# EAGLE schematic Schematics (EAGLE 9.7.0)
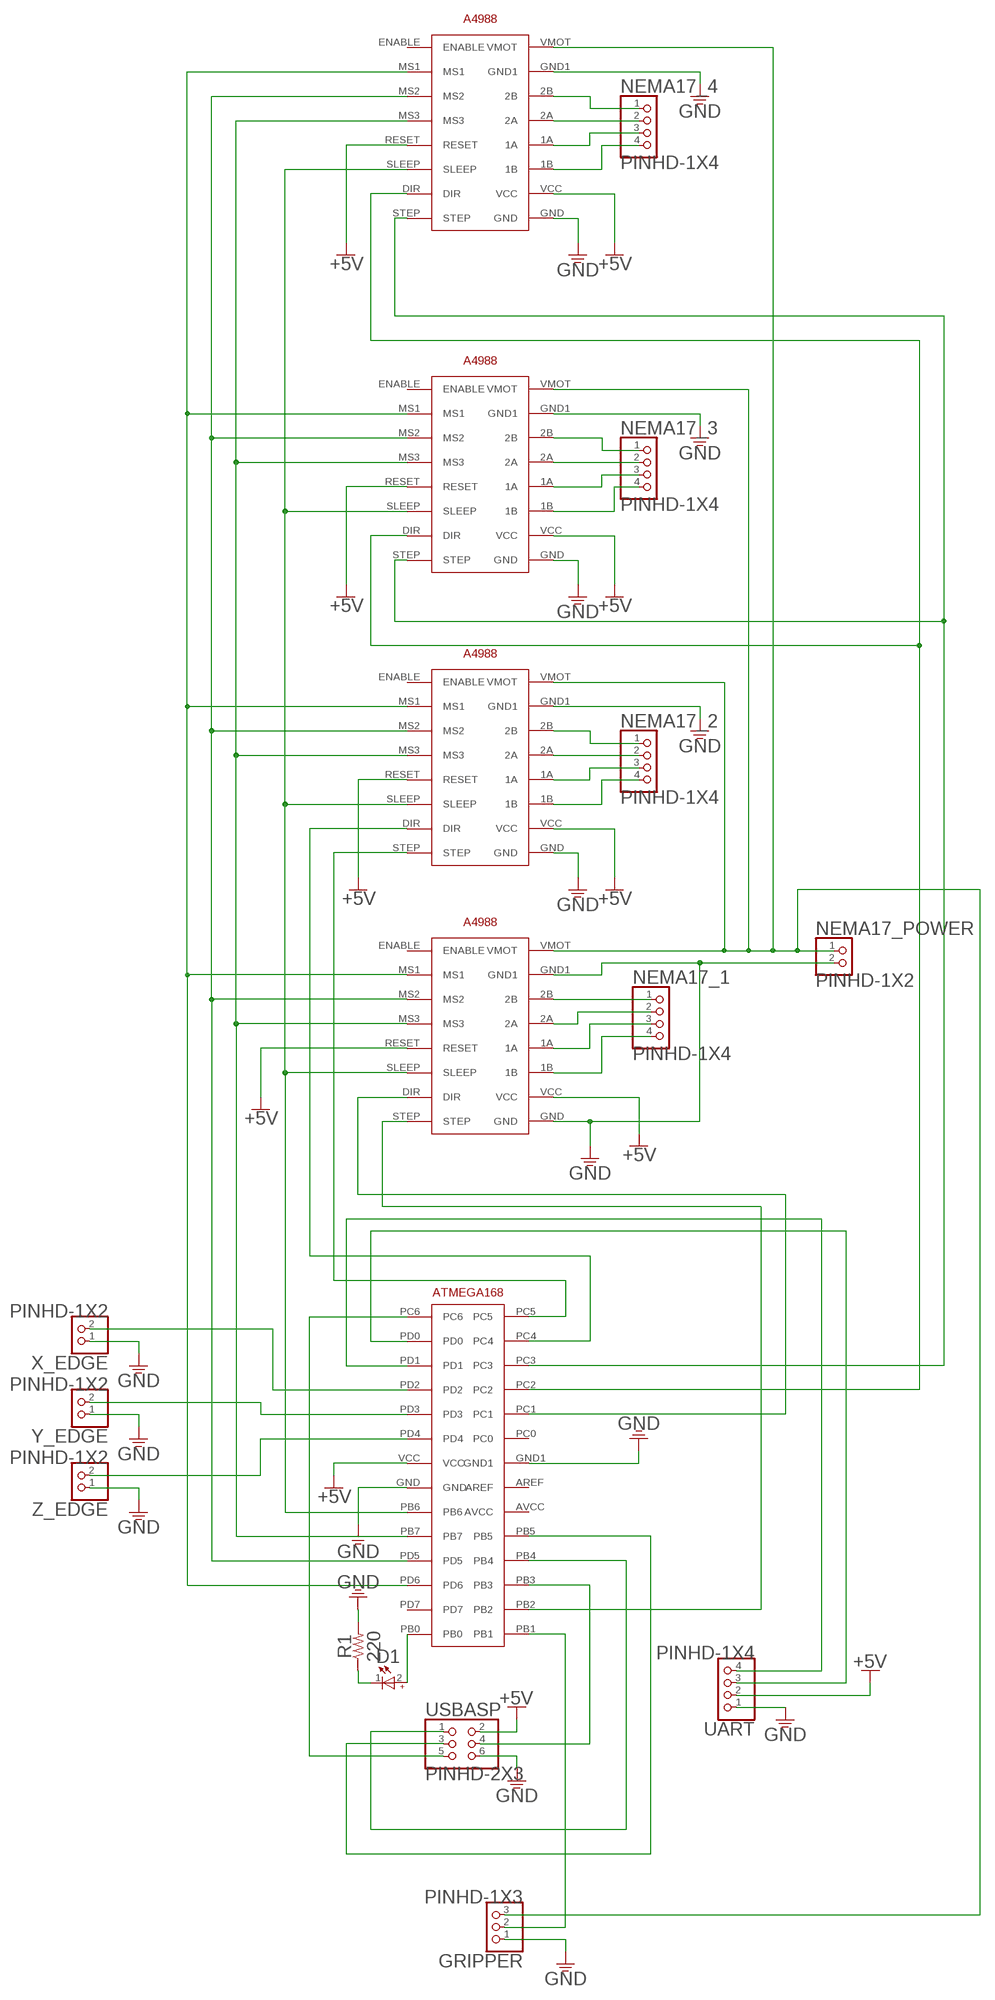
[diagram p0: schematic, sheet 1]

## Parts
D1  151033BS03000  WL-TMRW_3MM_151033BS03000_WITHSTOPPER  [WL-TMRW_3MM_STOPPER]
GRIPPER  PINHD-1X3  [1X03]
NEMA17_1  PINHD-1X4  [1X04]
NEMA17_2  PINHD-1X4  [1X04]
NEMA17_3  PINHD-1X4  [1X04]
NEMA17_4  PINHD-1X4  [1X04]
NEMA17_POWER  PINHD-1X2  [1X02]
R1  220  R-US_AXIAL-7.2MM-PITCH  [RESAD724W46L381D178B]
U$1  ATMEGA168  [ATMEGA168FOOTPRINT]
U$2  A4988  [A498-FOOTPRINT]
U$3  A4988  [A498-FOOTPRINT]
U$4  A4988  [A498-FOOTPRINT]
U$5  A4988  [A498-FOOTPRINT]
UART  PINHD-1X4  [1X04]
USBASP  PINHD-2X3  [2X03]
X_EDGE  PINHD-1X2  [1X02]
Y_EDGE  PINHD-1X2  [1X02]
Z_EDGE  PINHD-1X2  [1X02]

## Nets
+5V: U$1.VCC U$2.RESET U$2.VCC U$3.RESET U$3.VCC U$4.RESET U$4.VCC U$5.RESET U$5.VCC UART.2 USBASP.2
GND: GRIPPER.1 NEMA17_POWER.2 R1.2 U$1.GND U$1.GND1 U$2.GND U$2.GND1 U$3.GND U$3.GND1 U$4.GND U$4.GND1 U$5.GND U$5.GND1 UART.1 USBASP.6 X_EDGE.1 Y_EDGE.1 Z_EDGE.1
N$1: U$1.PB3 USBASP.4
N$2: U$1.PB4 USBASP.1
N$3: U$1.PB5 USBASP.3
N$4: U$1.PC6 USBASP.5
N$5: D1.2(+) U$1.PB0
N$6: D1.1(-) R1.1
N$7: U$1.PD0 UART.3
N$8: U$1.PD1 UART.4
N$10: NEMA17_1.1 U$2.2B
N$11: NEMA17_1.2 U$2.2A
N$12: NEMA17_1.3 U$2.1A
N$13: NEMA17_1.4 U$2.1B
N$14: U$1.PB2 U$2.STEP
N$15: GRIPPER.3 NEMA17_POWER.1 U$2.VMOT U$3.VMOT U$4.VMOT U$5.VMOT
N$16: U$1.PC1 U$2.DIR
N$17: U$1.PB6 U$2.SLEEP U$3.SLEEP U$4.SLEEP U$5.SLEEP
N$18: U$1.PB7 U$2.MS3 U$3.MS3 U$4.MS3 U$5.MS3
N$19: U$1.PD5 U$2.MS2 U$3.MS2 U$4.MS2 U$5.MS2
N$20: U$1.PD6 U$2.MS1 U$3.MS1 U$4.MS1 U$5.MS1
N$21: NEMA17_2.4 U$3.1B
N$22: NEMA17_2.3 U$3.1A
N$23: NEMA17_2.2 U$3.2A
N$24: NEMA17_2.1 U$3.2B
N$25: U$1.PC5 U$3.STEP
N$26: U$1.PC4 U$3.DIR
N$27: NEMA17_3.4 U$4.1B
N$28: NEMA17_3.3 U$4.1A
N$29: NEMA17_3.2 U$4.2A
N$30: NEMA17_3.1 U$4.2B
N$31: U$1.PC3 U$4.STEP U$5.STEP
N$32: U$1.PC2 U$4.DIR U$5.DIR
N$33: NEMA17_4.4 U$5.1B
N$34: NEMA17_4.3 U$5.1A
N$35: NEMA17_4.2 U$5.2A
N$36: NEMA17_4.1 U$5.2B
N$37: U$1.PD2 X_EDGE.2
N$38: U$1.PD3 Y_EDGE.2
N$39: U$1.PD4 Z_EDGE.2
N$40: GRIPPER.2 U$1.PB1
Unconnected: U$1.AREF U$1.AVCC U$1.PC0 U$1.PD7 U$2.ENABLE U$3.ENABLE U$4.ENABLE U$5.ENABLE

## Library data of the parts
D1 = Wurth_LEDs_WL-TMRW:WL-TMRW_3MM: WL-TMRW THT Mono-color Round Waterclear Characteristics Low energy consumption High reliability Low current requirement Fast switching No UV/IR radiation Easy installation Ultra high luminous efficacy Versatile mounting on PC boards With and without stopper Applications Indicator light Displays Traffic signal light Marker lights Commercial outdoor advertising Energy saving lamp Backlight LED Displays Electronic and optical indicator PBC mounted panel indicator Variable message sign <https://www.we-online.com/catalog/media/o14911v209%20Family_TMRW_THT.jpg> Details see: www.we-online.com/catalog/en/WL-TMRW <www.we-online.com/catalog/WL-TMRW/?utm_source=eagle_model&utm_medium=description_link&utm_campaign=eisos_eagle> Updated by Ella 2022-06-21 2022(C) Wurth Elektronik; CHIP-TECHNOLOGY: InGaN; DATASHEET-URL: https://www.we-online.com/redexpert/spec/151033BS03000?ae; DOMINANT-WAVELENGTH: 470nm; EMITTING-COLOR: Blue; FORWARD-VOLTAGE: 2.8V; LUMINOUS-INTENSITY: 3800mcd; PART-NUMBER: 151033BS03000; PEAK-WAVELENGTH: 465nm; VIEWING-ANGLE: 30°
GRIPPER = Connector:PINHD-1X3: PIN HEADER; CATEGORY: CONNECTOR; SUB-CATEGORY: PIN-HEADER
NEMA17_1-NEMA17_4 UART = Connector:PINHD-1X4: PIN HEADER; CATEGORY: CONNECTOR; SUB-CATEGORY: PIN-HEADER
NEMA17_POWER X_EDGE Y_EDGE Z_EDGE = Connector:PINHD-1X2: PIN HEADER; CATEGORY: CONNECTOR; SUB-CATEGORY: PIN-HEADER
R1 = Resistor:R-US: Resistor Fixed - ANSI; CATEGORY: Resistor; SUB-CATEGORY: Fixed
U$1 = ATMEGA168:ATMEGA168
U$2-U$5 = A4988:A4988
USBASP = Connector:PINHD-2X3: PIN HEADER; CATEGORY: CONNECTOR; SUB-CATEGORY: PIN-HEADER